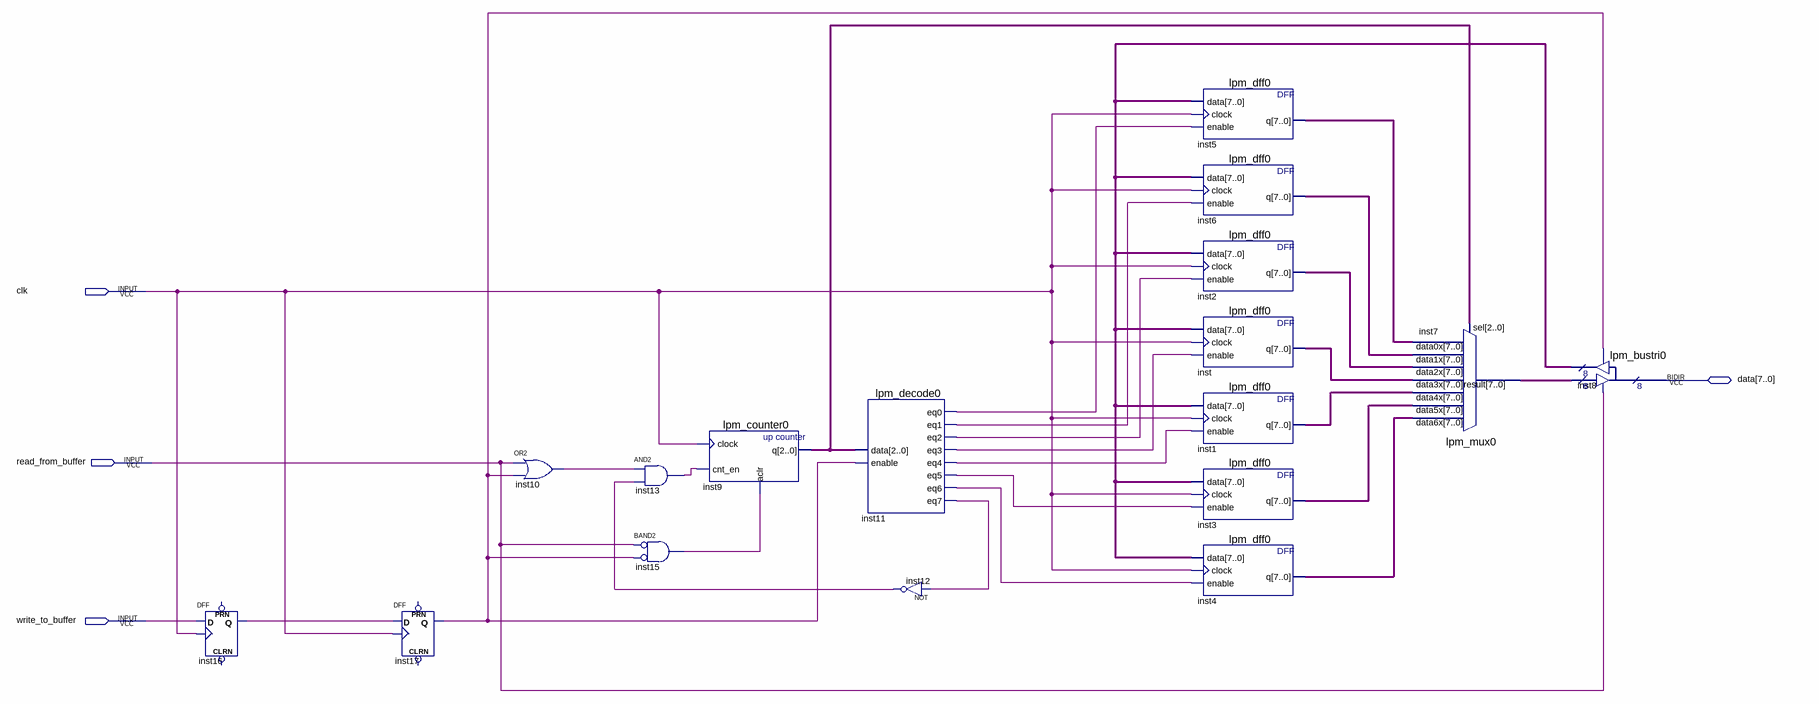
[diagram p0: schematic sheet]
// Quartus schematic BUFFER.bdf as structural Verilog: 17 symbols, 4 pins
module BUFFER (
  input  clk,
  input  read_from_buffer,
  input  write_to_buffer,
  inout  [7:0] data
);

  wire inst10_out, inst11_eq0, inst11_eq1, inst11_eq2, inst11_eq3, inst11_eq4, inst11_eq5, inst11_eq6,
       inst11_eq7, inst12_out, inst13_out, inst15_out, inst16_q, inst17_q;
  wire [2:0] inst9_q;
  wire [7:0] inst1_q, inst2_q, inst3_q, inst4_q, inst5_q, inst6_q, inst7_result, inst8_result, inst_q;

  DFF inst16 (.CLK(clk), .D(write_to_buffer), .Q(inst16_q));  // open: CLRN, PRN
  DFF inst17 (.CLK(clk), .D(inst16_q), .Q(inst17_q));  // open: CLRN, PRN
  or inst10 (inst10_out, read_from_buffer, inst17_q);
  and inst13 (inst13_out, inst10_out, inst12_out);
  and inst15 (inst15_out, ~read_from_buffer, ~inst17_q);  // BAND2
  lpm_counter0 inst9 (.clock(clk), .cnt_en(inst13_out), .aclr(inst15_out), .q(inst9_q));
  lpm_decode0 inst11 (
    .data(inst9_q), .enable(inst17_q), .eq0(inst11_eq0), .eq1(inst11_eq1), .eq2(inst11_eq2),
    .eq3(inst11_eq3), .eq4(inst11_eq4), .eq5(inst11_eq5), .eq6(inst11_eq6), .eq7(inst11_eq7));
  not inst12 (inst12_out, inst11_eq7);
  lpm_dff0 inst5 (.data(inst8_result), .clock(clk), .enable(inst11_eq0), .q(inst5_q));
  lpm_dff0 inst6 (.data(inst8_result), .clock(clk), .enable(inst11_eq1), .q(inst6_q));
  lpm_dff0 inst2 (.data(inst8_result), .clock(clk), .enable(inst11_eq2), .q(inst2_q));
  lpm_dff0 inst (.data(inst8_result), .clock(clk), .enable(inst11_eq3), .q(inst_q));
  lpm_dff0 inst1 (.data(inst8_result), .clock(clk), .enable(inst11_eq4), .q(inst1_q));
  lpm_dff0 inst3 (.data(inst8_result), .clock(clk), .enable(inst11_eq5), .q(inst3_q));
  lpm_dff0 inst4 (.data(inst8_result), .clock(clk), .enable(inst11_eq6), .q(inst4_q));
  lpm_mux0 inst7 (
    .data6x(inst4_q), .data5x(inst3_q), .data4x(inst1_q), .data3x(inst_q), .data2x(inst2_q),
    .data1x(inst6_q), .data0x(inst5_q), .sel(inst9_q), .result(inst7_result));
  lpm_bustri0 inst8 (
    .enabledt(read_from_buffer), .data(inst7_result), .enabletr(inst17_q), .result(inst8_result),
    .tridata(data));
endmodule
